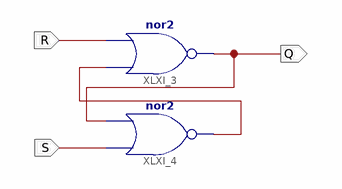
[diagram p0: schematic sheet 1]
// Xilinx ISE schematic RS_Trigger_XOR.sch (spartan6) as structural Verilog: 2 symbols, 3 ports
module RS_Trigger_XOR (
  input  R,
  input  S,
  output Q
);

  wire XLXN_7;

  nor XLXI_3 (Q, XLXN_7, R);
  nor XLXI_4 (XLXN_7, S, Q);
endmodule
